# EAGLE schematic MainECU rev4 (EAGLE 9.2.2)
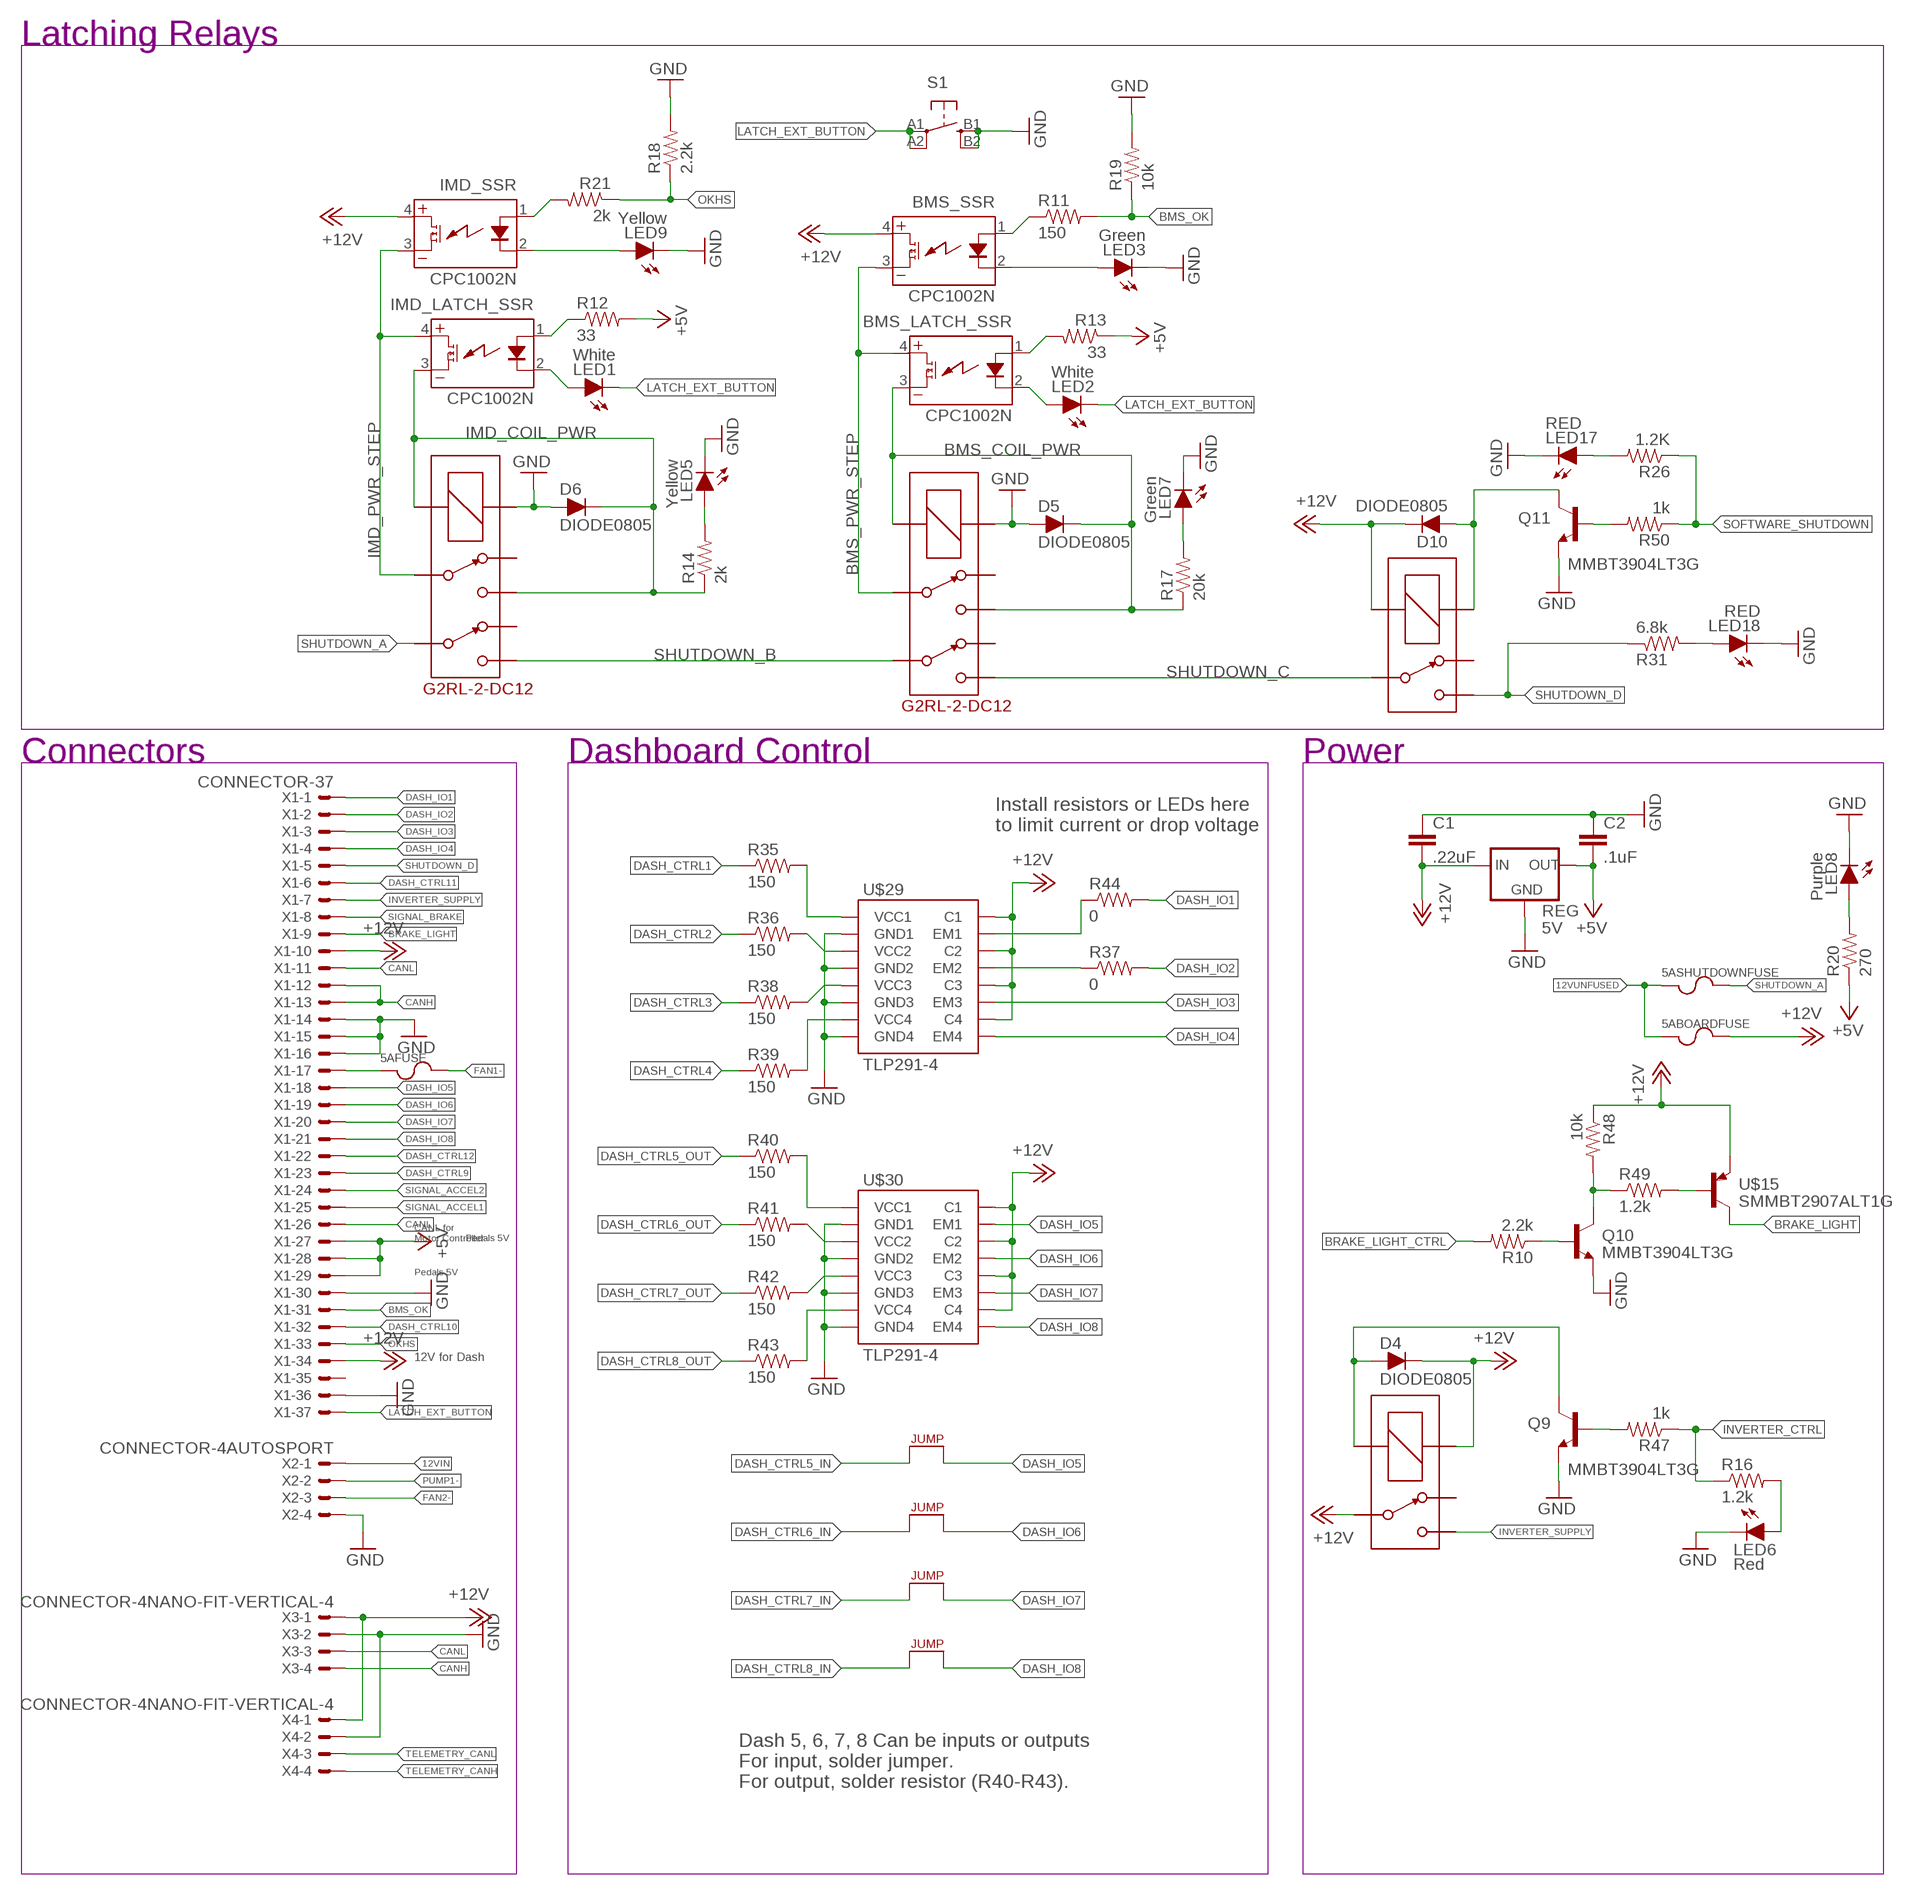
[diagram p0: schematic, sheet 1, part 1 of 2]
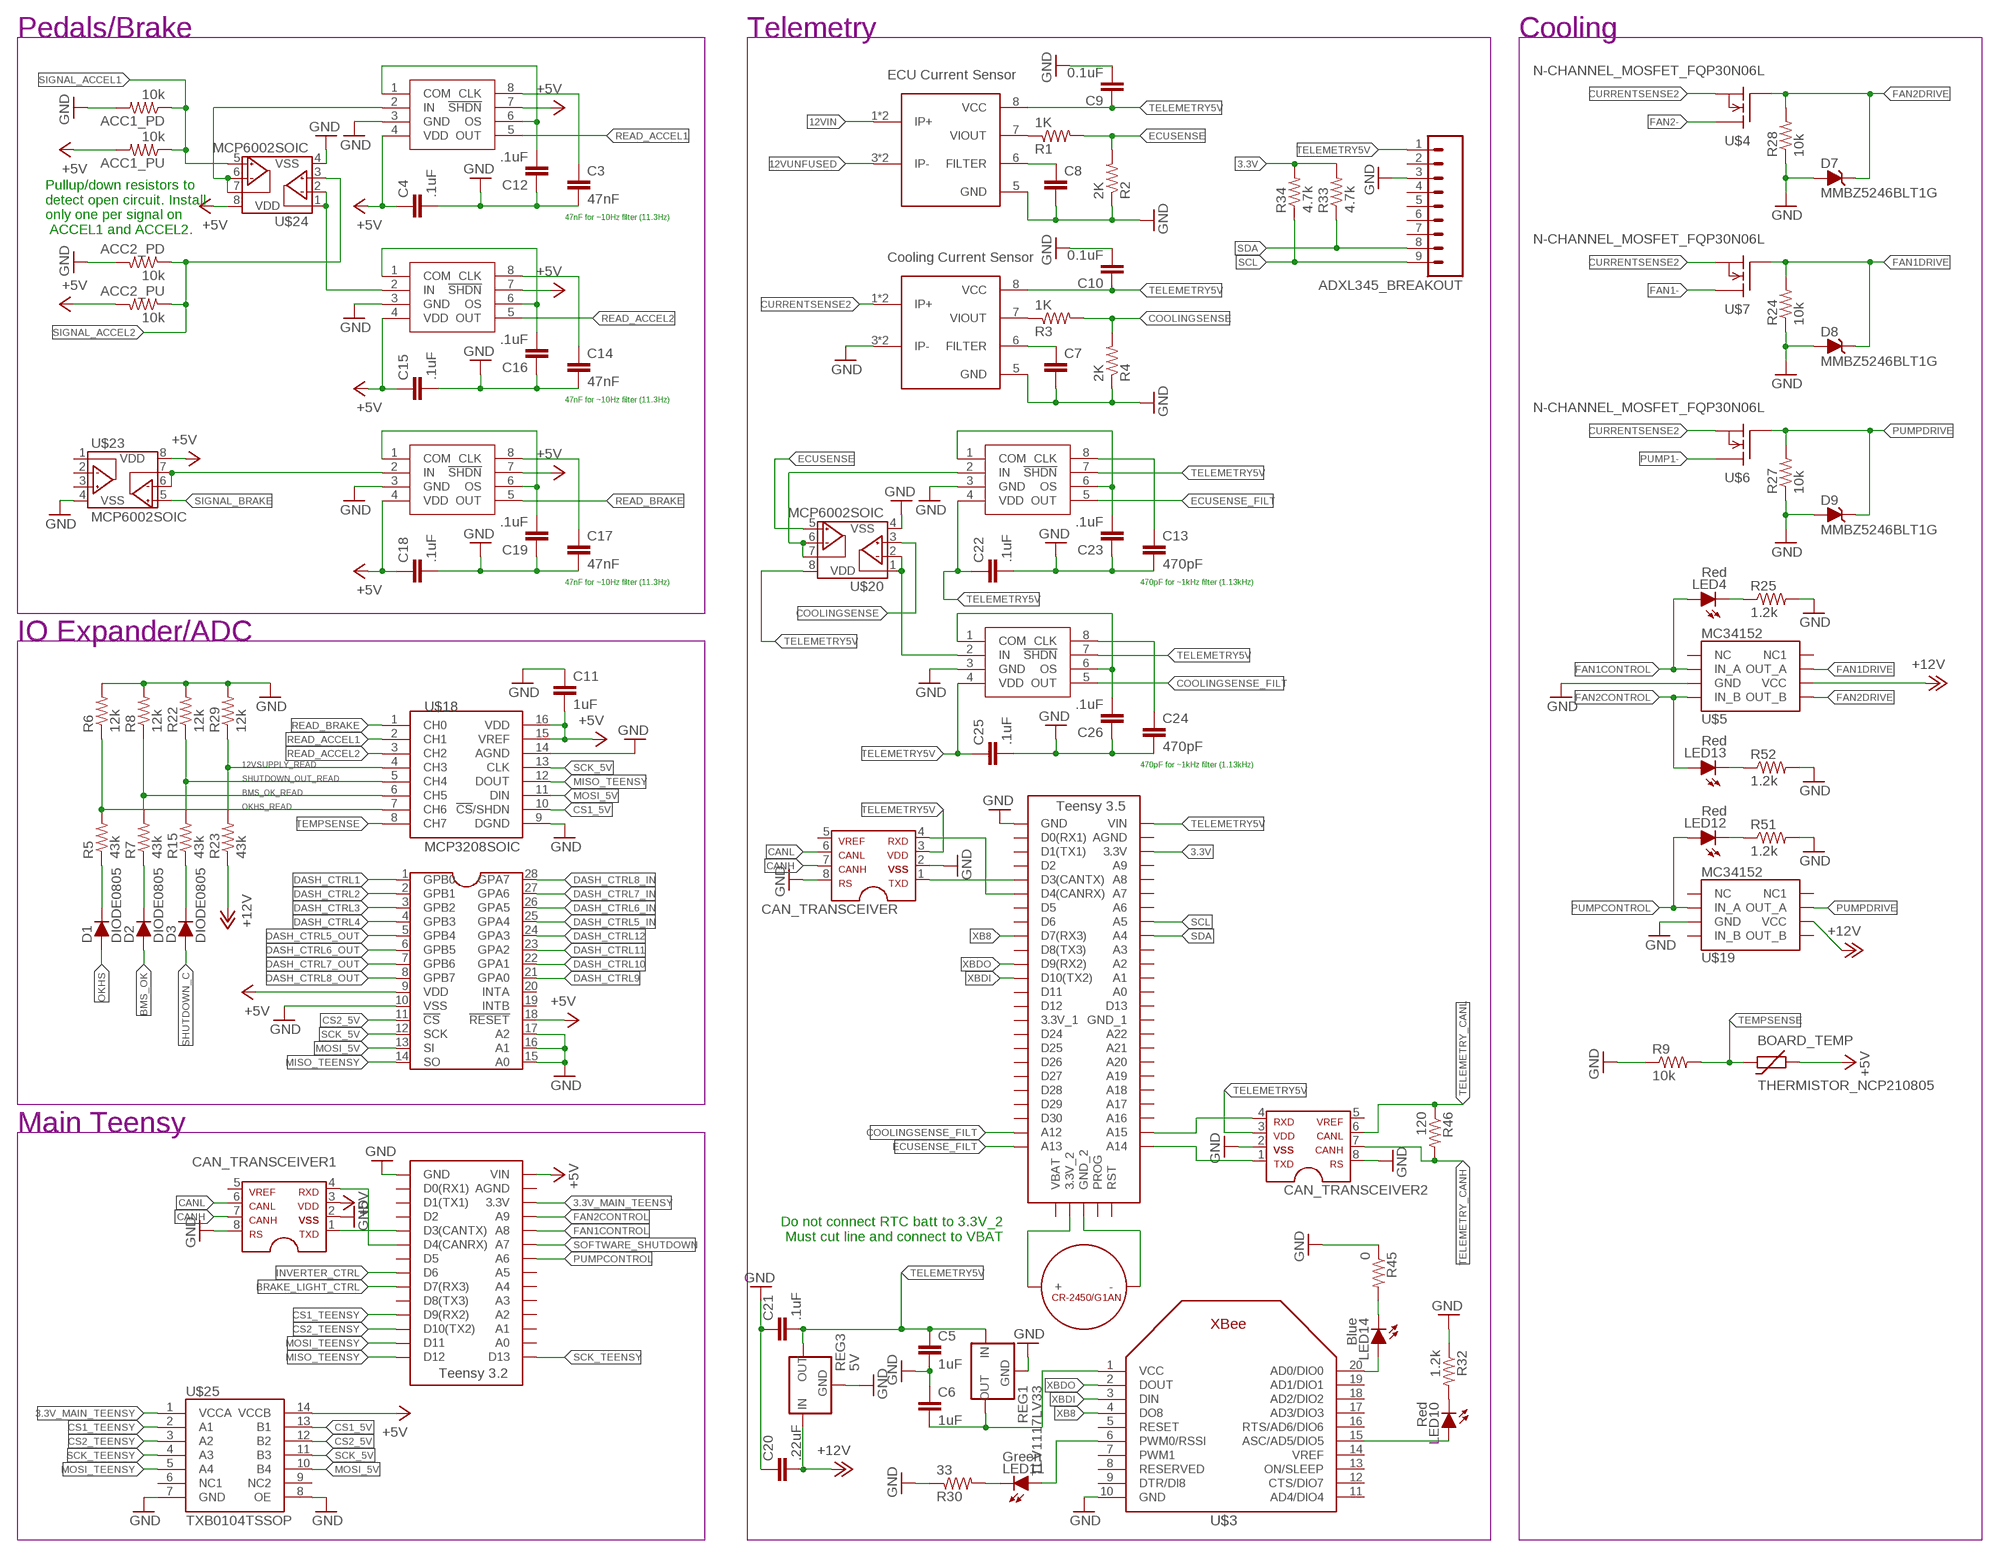
[diagram p1: schematic, sheet 1, part 2 of 2]

## Parts
5ABOARDFUSE  FUSE_MINIBLADE  [MINI-BLADE_FUSE_HOLDER]
5AFUSE  FUSE_MINIBLADE  [MINI-BLADE_FUSE_HOLDER]
5ASHUTDOWNFUSE  FUSE_MINIBLADE  [MINI-BLADE_FUSE_HOLDER]
ACC1_PD  10k  RESISTOR0805-RES  [0805]
ACC1_PU  10k  RESISTOR0805-RES  [0805]
ACC2_PD  10k  RESISTOR0805-RES  [0805]
ACC2_PU  10k  RESISTOR0805-RES  [0805]
ADXL345_BREAKOUT  M09  [1X09]
BMS_LATCH_SSR  CPC1002N  [SOP04]
BMS_SSR  CPC1002N  [SOP04]
BOARD_TEMP  THERMISTOR_NCP210805  [0805]
C1  .22uF  CAP0805  [0805]
C2  .1uF  CAP0805  [0805]
C3  47nF  CAP0805  [0805]
C4  .1uF  CAP0805  [0805]
C5  1uF  CAP0805  [0805]
C6  1uF  CAP0805  [0805]
C7  CAP0805  [0805]
C8  CAP0805  [0805]
C9  0.1uF  CAP0805  [0805]
C10  0.1uF  CAP0805  [0805]
C11  1uF  CAP0805  [0805]
C12  .1uF  CAP0805  [0805]
C13  470pF  CAP0805  [0805]
C14  47nF  CAP0805  [0805]
C15  .1uF  CAP0805  [0805]
C16  .1uF  CAP0805  [0805]
C17  47nF  CAP0805  [0805]
C18  .1uF  CAP0805  [0805]
C19  .1uF  CAP0805  [0805]
C20  .22uF  CAP0805  [0805]
C21  .1uF  CAP0805  [0805]
C22  .1uF  CAP0805  [0805]
C23  .1uF  CAP0805  [0805]
C24  470pF  CAP0805  [0805]
C25  .1uF  CAP0805  [0805]
C26  .1uF  CAP0805  [0805]
CAN_TRANSCEIVER  MCP2551  [SOIC-08]
CAN_TRANSCEIVER1  MCP2551  [SOIC-08]
CAN_TRANSCEIVER2  MCP2551  [SOIC-08]
D1  DIODE0805  [0805_D]
D2  DIODE0805  [0805_D]
D3  DIODE0805  [0805_D]
D4  DIODE0805  [0805_D]
D5  DIODE0805  [0805_D]
D6  DIODE0805  [0805_D]
D7  MMBZ5246BLT1G  DIODE_ZENER  [SOT23]
D8  MMBZ5246BLT1G  DIODE_ZENER  [SOT23]
D9  MMBZ5246BLT1G  DIODE_ZENER  [SOT23]
D10  DIODE0805  [0805_D]
IMD_LATCH_SSR  CPC1002N  [SOP04]
IMD_SHUTDOWN  G2RL-2-DC12  [G2RL-2]
IMD_SHUTDOWN1  G2RL-2-DC12  [G2RL-2]
IMD_SSR  CPC1002N  [SOP04]
LED1  White  LED-0805  [LED-805]
LED2  White  LED-0805  [LED-805]
LED3  Green  LED-0805  [LED-805]
LED4  Red  LED-0805  [LED-805]
LED5  Yellow  LED-0805  [LED-805]
LED6  Red  LED-0805  [LED-805]
LED7  Green  LED-0805  [LED-805]
LED8  Purple  LED-0805  [LED-805]
LED9  Yellow  LED-0805  [LED-805]
LED10  Red  LED-0805  [LED-805]
LED11  Green  LED-0805  [LED-805]
LED12  Red  LED-0805  [LED-805]
LED13  Red  LED-0805  [LED-805]
LED14  Blue  LED-0805  [LED-805]
LED17  RED  LED-0805  [LED-805]
LED18  RED  LED-0805  [LED-805]
Q9  MMBT3904LT3G  BJT_NPNSOT  [SOT23]
Q10  MMBT3904LT3G  BJT_NPNSOT  [SOT23]
Q11  MMBT3904LT3G  BJT_NPNSOT  [SOT23]
R1  1K  RESISTOR0805-RES  [0805]
R2  2K  RESISTOR0805-RES  [0805]
R3  1K  RESISTOR0805-RES  [0805]
R4  2K  RESISTOR0805-RES  [0805]
R5  43k  RESISTOR0805-RES  [0805]
R6  12k  RESISTOR0805-RES  [0805]
R7  43k  RESISTOR0805-RES  [0805]
R8  12k  RESISTOR0805-RES  [0805]
R9  10k  RESISTOR0805-RES  [0805]
R10  2.2k  RESISTOR0805-RES  [0805]
R11  150  RESISTOR0805-RES  [0805]
R12  33  RESISTOR0805-RES  [0805]
R13  33  RESISTOR0805-RES  [0805]
R14  2k  RESISTOR0805-RES  [0805]
R15  43k  RESISTOR0805-RES  [0805]
R16  1.2k  RESISTOR0805-RES  [0805]
R17  20k  RESISTOR0805-RES  [0805]
R18  2.2k  RESISTOR0805-RES  [0805]
R19  10k  RESISTOR0805-RES  [0805]
R20  270  RESISTOR0805-RES  [0805]
R21  2k  RESISTOR0805-RES  [0805]
R22  12k  RESISTOR0805-RES  [0805]
R23  43k  RESISTOR0805-RES  [0805]
R24  10k  RESISTOR0805-RES  [0805]
R25  1.2k  RESISTOR0805-RES  [0805]
R26  1.2K  RESISTOR0805-RES  [0805]
R27  10k  RESISTOR0805-RES  [0805]
R28  10k  RESISTOR0805-RES  [0805]
R29  12k  RESISTOR0805-RES  [0805]
R30  33  RESISTOR0805-RES  [0805]
R31  6.8k  RESISTOR0805-RES  [0805]
R32  1.2k  RESISTOR0805-RES  [0805]
R33  4.7k  RESISTOR0805-RES  [0805]
R34  4.7k  RESISTOR0805-RES  [0805]
R35  150  RESISTOR0805-RES  [0805]
R36  150  RESISTOR0805-RES  [0805]
R37  0  RESISTOR0805-RES  [0805]
R38  150  RESISTOR0805-RES  [0805]
R39  150  RESISTOR0805-RES  [0805]
R40  150  RESISTOR0805-RES  [0805]
R41  150  RESISTOR0805-RES  [0805]
R42  150  RESISTOR0805-RES  [0805]
R43  150  RESISTOR0805-RES  [0805]
R44  0  RESISTOR0805-RES  [0805]
R45  0  RESISTOR0805-RES  [0805]
R46  120  RESISTOR0805-RES  [0805]
R47  1k  RESISTOR0805-RES  [0805]
R48  10k  RESISTOR0805-RES  [0805]
R49  1.2k  RESISTOR0805-RES  [0805]
R50  1k  RESISTOR0805-RES  [0805]
R51  1.2k  RESISTOR0805-RES  [0805]
R52  1.2k  RESISTOR0805-RES  [0805]
REG  5V  OKI-78SR  [OKI-78SR]
REG1  TLV1117LV33  [SOT223]
REG3  5V  OKI-78SR  [OKI-78SR]
S1  BTN_10-XXSMD  [TACTILE_SWITCH_SMD_6.2MM_TALL]
SOFTWARE_SHUTOFF  G5LE  [ZF112]
U$1  TEENSY_3.2_SIMPLE  [TEENSY_3.2_SIMPLE]
U$2  TEENSY_3.5_EXT  [TEENSY_3.5_EXT]
U$3  XBEE  [XBEE]
U$4  N-CHANNEL_MOSFET_FQP30N06L  N-CHANNEL_MOSFET_HOR_HOLE  [TO-220-H-HOLE]
U$5  MC34152  [SOIC-08]
U$6  N-CHANNEL_MOSFET_FQP30N06L  N-CHANNEL_MOSFET_HOR_HOLE  [TO-220-H-HOLE]
U$7  N-CHANNEL_MOSFET_FQP30N06L  N-CHANNEL_MOSFET_HOR_HOLE  [TO-220-H-HOLE]
U$8  G5LE  [ZF112]
U$9  ACS715_CURRENT_SENSOR  [SOP8]
U$10  ACS715_CURRENT_SENSOR  [SOP8]
U$11  JUMPER  [0805]
U$12  JUMPER  [0805]
U$13  JUMPER  [0805]
U$14  JUMPER  [0805]
U$15  SMMBT2907ALT1G  BJT_PNPSOT  [SOT23]
U$16  CR-2450/G1AN  [CR-2450/G1AN]
U$17  MCP23S17SSOP28  [SSOP28]
U$18  MCP3208SOIC  [SOIC-16]
U$19  MC34152  [SOIC-08]
U$20  MCP6002SOIC  [SOIC-08]
U$21  MAX7480  [SOIC-08]
U$22  MAX7480  [SOIC-08]
U$23  MCP6002SOIC  [SOIC-08]
U$24  MCP6002SOIC  [SOIC-08]
U$25  TXB0104TSSOP  [TSSOP-14]
U$26  MAX7480  [SOIC-08]
U$27  MAX7480  [SOIC-08]
U$28  MAX7480  [SOIC-08]
U$29  TLP291-4  [11-11F1]
U$30  TLP291-4  [11-11F1]
X1  CONNECTOR-37  [AUTOSPORT_14-35]
X2  CONNECTOR-4AUTOSPORT  [AUTOSPORT_12-04]
X3  CONNECTOR-4NANO-FIT-VERTICAL-4  [NANO-FIT_VERTICAL-4]
X4  CONNECTOR-4NANO-FIT-VERTICAL-4  [NANO-FIT_VERTICAL-4]

## Nets
3.3V: R33.2 R34.2 U$2.3.3V
3.3V_MAIN_TEENSY: U$1.3.3V U$25.1(VCCA)
12VIN: U$9.1(IP+) U$9.2(IP+) X2.P$1
12VSUPPLY_READ: R23.2 R29.1 U$18.4(CH3)
12VUNFUSED: 5ABOARDFUSE.L1 5ABOARDFUSE.L2 5ASHUTDOWNFUSE.L1 5ASHUTDOWNFUSE.L2 U$9.3(IP-) U$9.4(IP-)
+5V: ACC1_PU.2 ACC2_PU.2 BOARD_TEMP.1 C2.2 C4.1 C11.2 C15.1 C18.1 CAN_TRANSCEIVER1.3 R12.2 R13.1 R20.1 REG.3(OUT) U$1.VIN U$17.9(VDD) U$17.18(!RESET) U$18.15(VREF) U$18.16(VDD) U$23.8(VDD) U$24.8(VDD) U$25.14(VCCB) U$26.4(VDD) U$26.7(!SHDN) U$27.4(VDD) U$27.7(!SHDN) U$28.4(VDD) U$28.7(!SHDN) X1.P$27 X1.P$28 X1.P$29
+12V: 5ABOARDFUSE.R1 5ABOARDFUSE.R2 BMS_SSR.4(DC+) C1.2 C20.2 D4.C D10.C IMD_SSR.4(DC+) R23.1 R48.1 REG3.1(IN) REG.1(IN) SOFTWARE_SHUTOFF.2(COIL-) U$5.6(VCC) U$8.1(COIL+) U$8.P U$15.2(E) U$19.6(VCC) U$29.10(C4) U$29.12(C3) U$29.14(C2) U$29.16(C1) U$30.10(C4) U$30.12(C3) U$30.14(C2) U$30.16(C1) X1.P$10 X1.P$34 X3.P$1 X4.P$1
BMS_COIL_PWR: BMS_LATCH_SSR.3(DC-) D5.C IMD_SHUTDOWN1.4 IMD_SHUTDOWN1.COIL- R17.1
BMS_OK: D2.A R11.2 R19.1 X1.P$31
BMS_OK_READ: R7.2 R8.1 U$18.6(CH5)
BMS_PWR_STEP: BMS_LATCH_SSR.4(DC+) BMS_SSR.3(DC-) IMD_SHUTDOWN1.3
BRAKE_LIGHT: U$15.3(C) X1.P$9
BRAKE_LIGHT_CTRL: R10.2 U$1.D7(RX3)
CANH: CAN_TRANSCEIVER1.7 CAN_TRANSCEIVER.7 X1.P$12 X1.P$13 X3.P$4
CANL: CAN_TRANSCEIVER1.6 CAN_TRANSCEIVER.6 X1.P$11 X1.P$26 X3.P$3
COOLINGSENSE: R3.2 R4.2 U$20.3(VINA+)
COOLINGSENSE_FILT: U$2.A12 U$22.5(OUT)
CS1_5V: U$18.10(!CS!/SHDN) U$25.13(B1)
CS1_TEENSY: U$1.D9(RX2) U$25.2(A1)
CS2_5V: U$17.11(!CS) U$25.12(B2)
CS2_TEENSY: U$1.D10(TX2) U$25.3(A2)
CURRENTSENSE2: U$4.3(S) U$6.3(S) U$7.3(S) U$10.1(IP+) U$10.2(IP+)
DASH_CTRL1: R35.1 U$17.1(GPB0)
DASH_CTRL2: R36.1 U$17.2(GPB1)
DASH_CTRL3: R38.1 U$17.3(GPB2)
DASH_CTRL4: R39.1 U$17.4(GPB3)
DASH_CTRL5_IN: U$12.2 U$17.25(GPA4)
DASH_CTRL5_OUT: R40.1 U$17.5(GPB4)
DASH_CTRL6_IN: U$11.2 U$17.26(GPA5)
DASH_CTRL6_OUT: R41.1 U$17.6(GPB5)
DASH_CTRL7_IN: U$13.2 U$17.27(GPA6)
DASH_CTRL7_OUT: R42.1 U$17.7(GPB6)
DASH_CTRL8_IN: U$14.2 U$17.28(GPA7)
DASH_CTRL8_OUT: R43.1 U$17.8(GPB7)
DASH_CTRL9: U$17.21(GPA0) X1.P$23
DASH_CTRL10: U$17.22(GPA1) X1.P$32
DASH_CTRL11: U$17.23(GPA2) X1.P$6
DASH_CTRL12: U$17.24(GPA3) X1.P$22
DASH_IO1: R44.2 X1.P$1
DASH_IO2: R37.2 X1.P$2
DASH_IO3: U$29.11(EM3) X1.P$3
DASH_IO4: U$29.9(EM4) X1.P$4
DASH_IO5: U$12.1 U$30.15(EM1) X1.P$18
DASH_IO6: U$11.1 U$30.13(EM2) X1.P$19
DASH_IO7: U$13.1 U$30.11(EM3) X1.P$20
DASH_IO8: U$14.1 U$30.9(EM4) X1.P$21
ECUSENSE: R1.2 R2.2 U$20.5(VINB+)
ECUSENSE_FILT: U$2.A13 U$21.5(OUT)
FAN1-: 5AFUSE.R1 5AFUSE.R2 U$7.2(D)
FAN1CONTROL: LED4.A U$1.A8 U$5.2(IN_A)
FAN1DRIVE: D8.3(C) R24.2 U$5.7(OUT_A) U$7.1(G)
FAN2-: U$4.2(D) X2.P$3
FAN2CONTROL: LED13.A U$1.A9 U$5.4(IN_B)
FAN2DRIVE: D7.3(C) R28.2 U$4.1(G) U$5.5(OUT_B)
GND: ACC1_PD.2 ACC2_PD.2 ADXL345_BREAKOUT.3 C1.1 C2.1 C3.2 C4.2 C5.2 C6.1 C7.2 C8.2 C9.2 C10.2 C11.1 C12.1 C13.2 C14.2 C15.2 C16.1 C17.2 C18.2 C19.1 C20.1 C21.1 C22.2 C23.1 C24.2 C25.2 C26.1 CAN_TRANSCEIVER1.2 CAN_TRANSCEIVER1.8 CAN_TRANSCEIVER2.2 CAN_TRANSCEIVER2.8 CAN_TRANSCEIVER.2 CAN_TRANSCEIVER.8 D5.A D6.A D7.1(A) D8.1(A) D9.1(A) IMD_SHUTDOWN1.COIL+ IMD_SHUTDOWN.COIL+ LED3.C LED5.C LED6.C LED7.C LED8.C LED9.C LED17.C LED18.C Q9.2(EMITTER) Q10.2(EMITTER) Q11.2(EMITTER) R2.1 R4.1 R6.2 R8.2 R9.1 R18.2 R19.2 R22.2 R24.1 R25.2 R27.1 R28.1 R29.2 R30.1 R32.1 R45.1 R51.2 R52.2 REG1.1(GND) REG3.2(GND) REG.2(GND) S1.B1(S) S1.B2(S1) U$1.GND U$2.GND U$3.10(GND) U$5.3(GND) U$9.5(GND) U$10.3(IP-) U$10.4(IP-) U$10.5(GND) U$17.10(VSS) U$17.15(A0) U$17.16(A1) U$17.17(A2) U$18.9(DGND) U$18.14(AGND) U$19.3(GND) U$20.4(VSS) U$21.3(GND) U$22.3(GND) U$23.4(VSS) U$24.4(VSS) U$25.7(GND) U$25.8(OE) U$26.3(GND) U$27.3(GND) U$28.3(GND) U$29.2(GND1) U$29.4(GND2) U$29.6(GND3) U$29.8(GND4) U$30.2(GND1) U$30.4(GND2) U$30.6(GND3) U$30.8(GND4) X1.P$14 X1.P$15 X1.P$16 X1.P$30 X1.P$36 X2.P$4 X3.P$2 X4.P$2
IMD_COIL_PWR: D6.C IMD_LATCH_SSR.3(DC-) IMD_SHUTDOWN.4 IMD_SHUTDOWN.COIL- R14.1
IMD_PWR_STEP: IMD_LATCH_SSR.4(DC+) IMD_SHUTDOWN.3 IMD_SSR.3(DC-)
INVERTER_CTRL: R16.1 R47.1 U$1.D6
INVERTER_SUPPLY: U$8.S X1.P$7
LATCH_EXT_BUTTON: LED1.C LED2.C S1.A1(P) S1.A2(P1) X1.P$37
MISO_TEENSY: U$1.D12 U$17.14(SO) U$18.12(DOUT)
MOSI_5V: U$17.13(SI) U$18.11(DIN) U$25.10(B4)
MOSI_TEENSY: U$1.D11 U$25.5(A4)
N$1: 5AFUSE.L1 5AFUSE.L2 X1.P$17
N$2: IMD_LATCH_SSR.2(CONTROL-) LED1.A
N$3: R1.1 U$9.7(VIOUT)
N$4: C12.2 U$27.1(COM) U$27.6(OS)
N$5: IMD_LATCH_SSR.1(CONTROL+) R12.1
N$6: R3.1 U$10.7(VIOUT)
N$7: Q10.1(BASE) R10.1
N$8: C8.1 U$9.6(FILTER)
N$9: BMS_SSR.2(CONTROL-) LED3.A
N$10: D1.C R5.1
N$11: D2.C R7.1
N$12: BMS_LATCH_SSR.1(CONTROL+) R13.2
N$13: CAN_TRANSCEIVER.4 U$2.D4(CANRX)
N$14: CAN_TRANSCEIVER.1 U$2.D3(CANTX)
N$15: CAN_TRANSCEIVER1.4 U$1.D4(CANRX)
N$16: BMS_LATCH_SSR.2(CONTROL-) LED2.A
N$17: Q10.3(COLLECTOR) R48.2 R49.1
N$18: BMS_SSR.1(CONTROL+) R11.1
N$19: LED5.A R14.2
N$20: U$20.1(VOUTA) U$20.2(VINA-) U$22.2(IN)
N$21: C3.1 U$27.8(CLK)
N$22: CAN_TRANSCEIVER1.1 U$1.D3(CANTX)
N$23: U$24.1(VOUTA) U$24.2(VINA-) U$28.2(IN)
N$24: U$24.6(VINB-) U$24.7(VOUTB) U$27.2(IN)
N$25: U$23.6(VINB-) U$23.7(VOUTB) U$26.2(IN)
N$26: Q11.1(BASE) R50.2
N$27: D10.A Q11.3(COLLECTOR) SOFTWARE_SHUTOFF.1(COIL+)
N$28: LED6.A R16.2
N$29: LED8.A R20.2
N$30: R36.2 U$29.3(VCC2)
N$31: IMD_SSR.1(CONTROL+) R21.2
N$32: LED7.A R17.2
N$33: D3.C R15.1
N$34: IMD_SSR.2(CONTROL-) LED9.A
N$35: LED14.C R45.2
N$36: C16.2 U$28.1(COM) U$28.6(OS)
N$37: C19.2 U$26.1(COM) U$26.6(OS)
N$38: C14.1 U$28.8(CLK)
N$39: U$20.6(VINB-) U$20.7(VOUTB) U$21.2(IN)
N$40: LED18.A R31.2
N$41: C17.1 U$26.8(CLK)
N$42: R37.1 U$29.13(EM2)
N$43: C23.2 U$21.1(COM) U$21.6(OS)
N$44: C13.1 U$21.8(CLK)
N$45: LED11.C R30.2
N$46: LED17.A R26.2
N$47: LED11.A U$3.6(PWM0/RSSI)
N$48: C7.1 U$10.6(FILTER)
N$49: LED10.A U$3.15(ASC/AD5/DIO5)
N$50: LED10.C R32.2
N$51: R35.2 U$29.1(VCC1)
N$52: R38.2 U$29.5(VCC3)
N$53: R39.2 U$29.7(VCC4)
N$54: R40.2 U$30.1(VCC1)
N$55: R41.2 U$30.3(VCC2)
N$56: R42.2 U$30.5(VCC3)
N$57: R43.2 U$30.7(VCC4)
N$58: R49.2 U$15.1(B)
N$59: R44.1 U$29.15(EM1)
N$60: U$2.3.3V_2 U$16.+_0(+) U$16.+_1(+)
N$61: U$2.GND_2 U$16.-
N$62: CAN_TRANSCEIVER2.4 U$2.A15
N$63: LED14.A U$3.20(AD0/DIO0)
N$64: CAN_TRANSCEIVER2.1 U$2.A14
N$65: Q9.1(BASE) R47.2
N$66: D4.A Q9.3(COLLECTOR) U$8.2(COIL-)
N$67: C26.2 U$22.1(COM) U$22.6(OS)
N$68: C24.1 U$22.8(CLK)
N$69: LED4.C R25.1
N$70: LED12.C R51.1
N$71: LED13.C R52.1
OKHS: D1.A R18.1 R21.1 X1.P$33
OKHS_READ: R5.2 R6.1 U$18.7(CH6)
PUMP1-: U$6.2(D) X2.P$2
PUMPCONTROL: LED12.A U$1.A6 U$19.2(IN_A)
PUMPDRIVE: D9.3(C) R27.2 U$6.1(G) U$19.7(OUT_A)
READ_ACCEL1: U$18.2(CH1) U$27.5(OUT)
READ_ACCEL2: U$18.3(CH2) U$28.5(OUT)
READ_BRAKE: U$18.1(CH0) U$26.5(OUT)
SCK_5V: U$17.12(SCK) U$18.13(CLK) U$25.11(B3)
SCK_TEENSY: U$1.D13 U$25.4(A3)
SCL: ADXL345_BREAKOUT.9 R34.1 U$2.A5
SDA: ADXL345_BREAKOUT.8 R33.1 U$2.A4
SHUTDOWN_A: 5ASHUTDOWNFUSE.R1 5ASHUTDOWNFUSE.R2 IMD_SHUTDOWN.6
SHUTDOWN_B: IMD_SHUTDOWN1.6 IMD_SHUTDOWN.5
SHUTDOWN_C: D3.A IMD_SHUTDOWN1.5 SOFTWARE_SHUTOFF.P
SHUTDOWN_D: R31.1 SOFTWARE_SHUTOFF.S X1.P$5
SHUTDOWN_OUT_READ: R15.2 R22.1 U$18.5(CH4)
SIGNAL_ACCEL1: ACC1_PD.1 ACC1_PU.1 U$24.5(VINB+) X1.P$25
SIGNAL_ACCEL2: ACC2_PD.1 ACC2_PU.1 U$24.3(VINA+) X1.P$24
SIGNAL_BRAKE: U$23.5(VINB+) X1.P$8
SOFTWARE_SHUTDOWN: R26.1 R50.1 U$1.A7
TELEMETRY5V: ADXL345_BREAKOUT.1 C5.1 C9.1 C10.1 C21.2 C22.1 C25.1 CAN_TRANSCEIVER2.3 CAN_TRANSCEIVER.3 REG1.3(IN) REG3.3(OUT) U$2.VIN U$9.8(VCC) U$10.8(VCC) U$20.8(VDD) U$21.4(VDD) U$21.7(!SHDN) U$22.4(VDD) U$22.7(!SHDN)
TELEMETRY_CANH: CAN_TRANSCEIVER2.7 R46.2 X4.P$4
TELEMETRY_CANL: CAN_TRANSCEIVER2.6 R46.1 X4.P$3
TEMPSENSE: BOARD_TEMP.2 R9.2 U$18.8(CH7)
VCC: C6.2 REG1.2(OUT) REG1.4(OUT) U$3.1(VCC)
XB8: U$2.D7(RX3) U$3.4(DO8)
XBDI: U$2.D10(TX2) U$3.3(DIN)
XBDO: U$2.D9(RX2) U$3.2(DOUT)
Unconnected: ADXL345_BREAKOUT.2 ADXL345_BREAKOUT.4 ADXL345_BREAKOUT.5 ADXL345_BREAKOUT.6 ADXL345_BREAKOUT.7 CAN_TRANSCEIVER1.5 CAN_TRANSCEIVER2.5 CAN_TRANSCEIVER.5 IMD_SHUTDOWN1.2 IMD_SHUTDOWN1.7 IMD_SHUTDOWN.2 IMD_SHUTDOWN.7 SOFTWARE_SHUTOFF.O U$1.A0 U$1.A1 U$1.A2 U$1.A3 U$1.A4 U$1.A5 U$1.AGND U$1.D0(RX1) U$1.D1(TX1) U$1.D2 U$1.D5 U$1.D8(TX3) U$2.3.3V_1 U$2.A0 U$2.A1 U$2.A2 U$2.A3 U$2.A6 U$2.A7 U$2.A8 U$2.A9 U$2.A16 U$2.A17 U$2.A18 U$2.A19 U$2.A20 U$2.A21 U$2.A22 U$2.AGND U$2.D0(RX1) U$2.D1(TX1) U$2.D2 U$2.D5 U$2.D6 U$2.D8(TX3) U$2.D11 U$2.D12 U$2.D13 U$2.D24 U$2.D25 U$2.D26 U$2.D27 U$2.D28 U$2.D29 U$2.D30 U$2.GND_1 U$2.PROG U$2.RST U$2.VBAT U$3.5(RESET) U$3.7(PWM1) U$3.8(RESERVED) U$3.9(DTR/DI8) U$3.11(AD4/DIO4) U$3.12(CTS/DIO7) U$3.13(ON/SLEEP) U$3.14(VREF) U$3.16(RTS/AD6/DIO6) U$3.17(AD3/DIO3) U$3.18(AD2/DIO2) U$3.19(AD1/DIO1) U$5.1(NC) U$5.8(NC1) U$8.O U$17.19(INTB) U$17.20(INTA) U$19.1(NC) U$19.4(IN_B) U$19.5(OUT_B) U$19.8(NC1) U$23.1(VOUTA) U$23.2(VINA-) U$23.3(VINA+) U$25.6(NC1) U$25.9(NC2) X1.P$35

## Notes on the sheet
- Latching Relays | Pedals/Brake | Telemetry | Cooling
- ECU Current Sensor
- 47nF for ~10Hz filter (11.3Hz)
- Pullup/down resistors to 
  detect open circuit. Install
  only one per signal on
   ACCEL1 and ACCEL2.
- Cooling Current Sensor
- 47nF for ~10Hz filter (11.3Hz)
- 47nF for ~10Hz filter (11.3Hz) | 470pF for ~1kHz filter (1.13kHz)
- Connectors | Dashboard Control | Power
- IO Expander/ADC
- Install resistors or LEDs here
  to limit current or drop voltage
- 470pF for ~1kHz filter (1.13kHz)
- CANL for
  Motor Controller
- Pedals 5V
- Pedals 5V
- 12V for Dash
- Main Teensy
- Do not connect RTC batt to 3.3V_2➡
  Must cut line and connect to VBAT➡
- Dash 5, 6, 7, 8 Can be inputs or outputs
  For input, solder jumper.
  For output, solder resistor (R40-R43).

## Library data of the parts
5ABOARDFUSE 5AFUSE 5ASHUTDOWNFUSE = HyTechDevices:FUSE: Fuse/Fuseclips Keystone Electronics 3568 Fuse Mouser Part <http://www.mouser.com/ProductDetail/Keystone-Electronics/3568> Datasheet <http://www.mouser.com/ds/2/215/568-742601.pdf> Bussman/Eaton Midget Fuse Clip 1A3400 <http://www.mouser.com/ProductDetail/Bussmann-Eaton/BK-1A3400-09-R/?qs=sGAEpiMZZMuG%252bgnN5hGYGzzlAelq2OxnKqVSMVjq8I4%3d> Schurter 0751.0110 Brass Fuse Clip Datasheet <http://www.mouser.com/ds/2/358/typ_OG__Clip__5x20-2553.pdf>
ACC1_PD ACC1_PU ACC2_PD ACC2_PU R1-R52 = HyTechDevices:RESISTOR: Resistor Basic schematic elements and footprints for 0603, 1206, and PTH resistors.
ADXL345_BREAKOUT = HyTechDevices:M09: Standard 9-pin 0.1" header. Source: Sparkfun <https://github.com/sparkfun/SparkFun-Eagle-Libraries>
BMS_LATCH_SSR BMS_SSR IMD_LATCH_SSR IMD_SSR = HyTechDevices:CPC1002N: IXYS Solid State Relay .7A
BOARD_TEMP = HyTechDevices:THERMISTOR_NCP21: Murata NCP Thermistor Datasheet <http://www.murata.com/~/media/webrenewal/support/library/catalog/products/thermistor/ntc/r44e.ashx>
C1-C26 = HyTechDevices:CAP: Capacitor Standard 0603 ceramic capacitor, and 0.1" leaded capacitor.
CAN_TRANSCEIVER CAN_TRANSCEIVER1 CAN_TRANSCEIVER2 = HyTechDevices:MCP2551: MCP2551 High-Speed CAN Transceiver Product Webpage <https://www.microchip.com/wwwproducts/en/MCP2551> Datasheet <http://ww1.microchip.com/downloads/en/DeviceDoc/21667f.pdf> This device is outdated It is replaced by MCP2561. Comparison Page <https://www.microchip.com/wwwproducts/ProductCompare/MCP2551/MCP2561> Product Webpage <https://www.microchip.com/wwwproducts/en/MCP2561> Datasheet <http://ww1.microchip.com/downloads/en/DeviceDoc/20005167C.pdf>
D1-D6 D10 = HyTechDevices:DIODE: DIODE general purpose rectifier
D7-D9 = HyTechDevices:DIODE_ZENER: ZENER DIODE
IMD_SHUTDOWN IMD_SHUTDOWN1 = HyTechDevices:G2RL-2-DC12: Omron G2RL-2 Double Pull Double Throw Relay Coil Voltage: 12VDC (8.4-18VDC @60ºC) Contact Amperage: 8A at 30VDC Datasheet <https://www.omron.com/ecb/products/pdf/en-g2rl.pdf>
LED1-LED14 LED17 LED18 = HyTechDevices:LED: Light Emitting Diode (LED) Source: Dangerous Prototypes Eagle Library <https://github.com/DangerousPrototypes/Eagle_Part_Library>
Q9-Q11 = HyTechDevices:BJT_NPN: Generic NPN BJT MMBT2222A - TRANS-08049 (SOT-23, 1A 40V) MPSA42 - TRANS-09116 (SOT-23, 500mA 300V) MMBT5088LT1G - TRANS-11160 (SOT-23, 50 mA 30V) BC547 - COM-08928 <http://www.sparkfun.com/products/8928> (TO-92 45V 100mA) (1.Collector 2.Base 3.Emitter) 2N3904 - COM-00521 <http://www.sparkfun.com/products/521> (TO-92 40V 200mA) (1.Emitter 2.Base 3.Collector) P2N2222A - COM-12852 <http://www.sparkfun.com/products/12852> (TO-92 40V 600mA) (1.Collector 2.Base 3.Emitter) Source: Sparkfun <https://github.com/sparkfun/SparkFun-Eagle-Libraries>
REG REG3 = HyTechDevices:OKI-78SR: Murata OKI-78SR Non-Isolated Switching Regulator DC/DC - Datasheet <https://power.murata.com/data/power/oki-78sr.pdf>
REG1 = HyTechDevices:TLV1117LV33: Texas Instruments TLV1117LV33 3.3V Linear Regulator
S1 = HyTechDevices:BTN_10-XX: Small momentary tactile push button
SOFTWARE_SHUTOFF U$8 = HyTechDevices:G5LE: Omron G5LE SPST Relay 5 VDC, 12VDC, 24VDC models Coil voltage: 75% - 170% of nominal voltage Datasheet <https://www.omron.com/ecb/products/pdf/en-g5le.pdf>
U$1 = HyTechDevices:TEENSY_3.2_SIMPLE: Simple version of the Teensy 3.2 board that only uses the 2 main rows of pins, not the inner pins or the pins opposite the usb port.
U$2 = HyTechDevices:TEENSY_3.5_EXT: Simple version of the Teensy 3.5 board that only uses the 2 main rows of pins, plus the perpendicular row with VBat.
U$3 = HyTechDevices:XBEE: Source: Adafruit <https://github.com/adafruit/Adafruit-Eagle-Library>
U$4 U$6 U$7 = HyTechDevices:N-CHANNEL_MOSFET: Generic N-Channel MOSFET
U$5 U$19 = HyTechDevices:MC34152: Microchip MC34152 High Speed Dual MOSFET Driver
U$9 U$10 = HyTechDevices:ACS715_CURRENT_SENSOR
U$11-U$14 = HyTechDevices:JUMPER: Jumper for changing operation of a device
U$15 = HyTechDevices:BJT_PNP: Generic PNP BJT
U$16 = HyTechDevices:CR-2450/G1AN: Panasonic CR2450 Battery through hole.
U$17 = HyTechDevices:MCP23S17
U$18 = HyTechDevices:MCP3208: Analog to Digital Converter
U$20 U$23 U$24 = HyTechDevices:MCP6002: Microchip MCP6002 Dual Channel Op Amp
U$21 U$22 U$26-U$28 = HyTechDevices:MAX7480: 8th-order lowpass butterworth filter
U$25 = HyTechDevices:TXB0104: Texas Instruments TXB0104 4-channel low voltage to high voltage Logic Level Shifter. Minimum input voltage level 1.8V. Maximum output voltage level 5.5V.
U$29 U$30 = HyTechDevices:TLP291-4: Toshiba Quad Channel Optocoupler TLP291-4 DC
X1 = HyTechDevices:CONNECTOR-37: Mini-Fit Junior connector 12 pole Source: http://www.molex.com
X2-X4 = HyTechDevices:CONNECTOR-4: Mini-Fit Junior connector 4 pole Source: http://www.molex.com